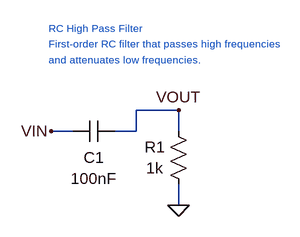
[diagram p0: schematic rc_high_pass_filter.asc]
rc_high_pass_filter.asc, the LTspice schematic file:
Version 4
SHEET 1 528 368
SYMBOL cap 160 208 R270
WINDOW 0 -24 32 VCenter 2
WINDOW 3 -56 32 VCenter 2
SYMATTR InstName C1
SYMATTR Value 100nF
SYMBOL res 304 176 R0
WINDOW 0 -20 40 Center 2
WINDOW 3 -20 72 Center 2
SYMATTR InstName R1
SYMATTR Value 1k
WIRE 128 192 160 192
WIRE 224 192 256 192
WIRE 256 160 256 192
WIRE 256 160 320 160
WIRE 320 160 320 192
WIRE 320 272 320 304
FLAG 320 304 0
FLAG 128 192 VIN
FLAG 320 160 VOUT
TEXT 124 36 Left 1 ;RC High Pass Filter
TEXT 124 60 Left 1 ;First-order RC filter that passes high frequencies
TEXT 124 84 Left 1 ;and attenuates low frequencies.

The netlist it stands for:
* rc_high_pass_filter.asc
C1 VIN VOUT 100nF
R1 VOUT 0 1k
* RC High Pass Filter
* First-order RC filter that passes high frequencies
* and attenuates low frequencies.
.backanno
.end